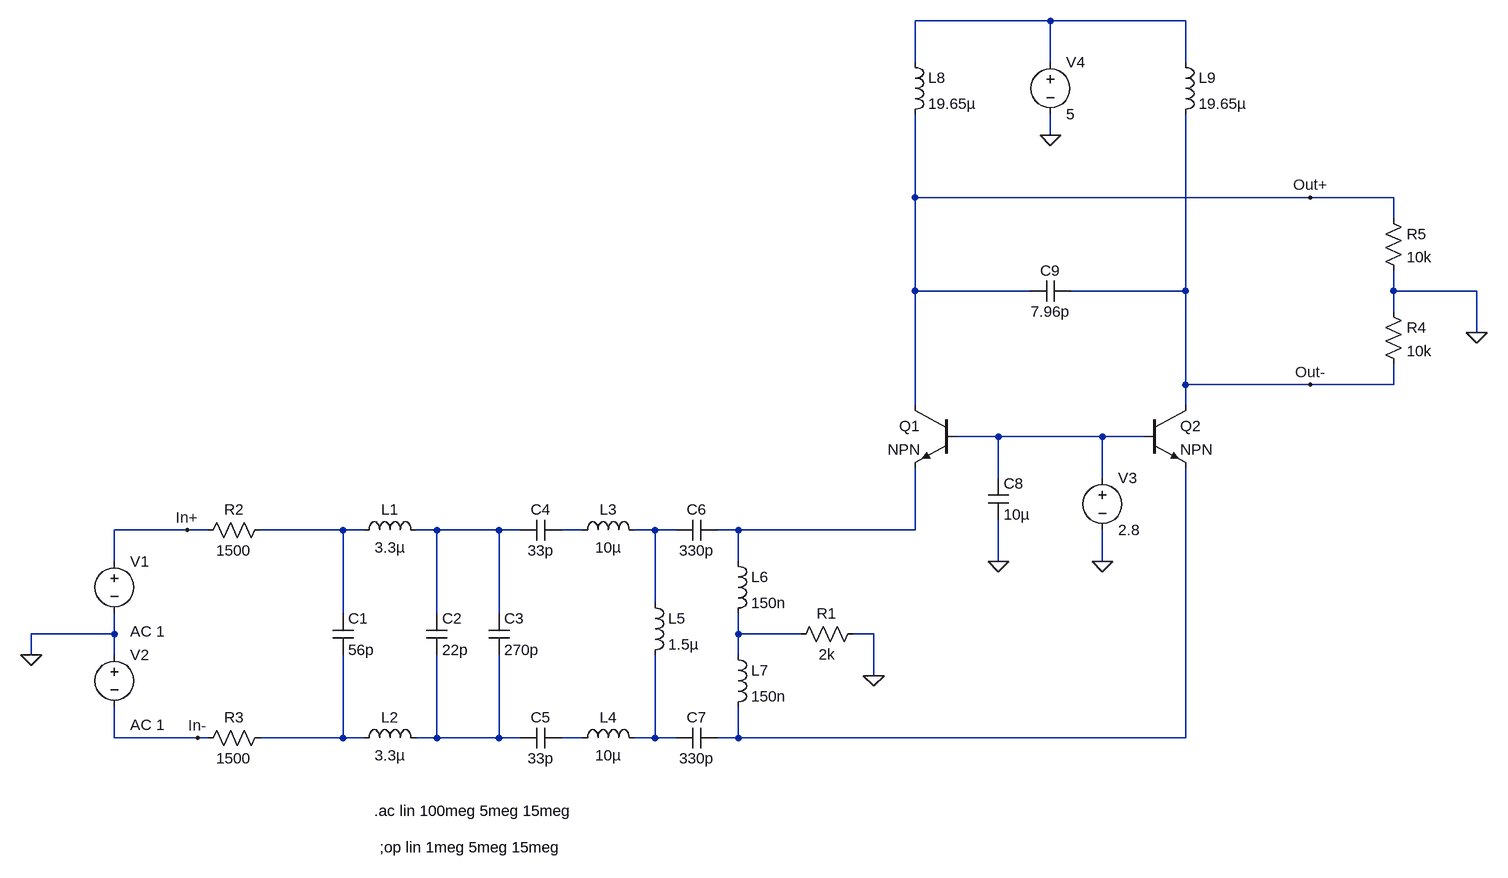
[diagram p0: schematic cb_diff_amp.asc]
cb_diff_amp.asc, the LTspice schematic file:
Version 4
SHEET 1 2580 680
WIRE 1040 -720 832 -720
WIRE 1248 -720 1040 -720
WIRE 832 -656 832 -720
WIRE 1040 -656 1040 -720
WIRE 1248 -656 1248 -720
WIRE 1040 -544 1040 -576
WIRE 832 -448 832 -576
WIRE 1440 -448 832 -448
WIRE 1568 -448 1440 -448
WIRE 1568 -416 1568 -448
WIRE 832 -304 832 -448
WIRE 1008 -304 832 -304
WIRE 1248 -304 1248 -576
WIRE 1248 -304 1072 -304
WIRE 1568 -304 1568 -336
WIRE 1696 -304 1568 -304
WIRE 1568 -272 1568 -304
WIRE 1696 -240 1696 -304
WIRE 1248 -160 1248 -304
WIRE 1440 -160 1248 -160
WIRE 1568 -160 1568 -192
WIRE 1568 -160 1440 -160
WIRE 832 -128 832 -304
WIRE 1248 -128 1248 -160
WIRE 960 -80 896 -80
WIRE 1120 -80 960 -80
WIRE 1184 -80 1120 -80
WIRE 960 -16 960 -80
WIRE 1120 -16 1120 -80
WIRE -288 64 -400 64
WIRE -256 64 -288 64
WIRE -48 64 -176 64
WIRE -16 64 -48 64
WIRE 96 64 64 64
WIRE 192 64 96 64
WIRE 224 64 192 64
WIRE 320 64 288 64
WIRE 432 64 400 64
WIRE 464 64 432 64
WIRE 560 64 528 64
WIRE 832 64 832 -32
WIRE 832 64 560 64
WIRE -400 112 -400 64
WIRE 560 112 560 64
WIRE 960 112 960 48
WIRE 1120 112 1120 64
WIRE 432 176 432 64
WIRE -48 192 -48 64
WIRE 96 192 96 64
WIRE 192 192 192 64
WIRE -400 224 -400 192
WIRE -400 224 -528 224
WIRE 560 224 560 192
WIRE 656 224 560 224
WIRE 768 224 736 224
WIRE -528 256 -528 224
WIRE -400 256 -400 224
WIRE 560 256 560 224
WIRE 768 288 768 224
WIRE -400 384 -400 336
WIRE -272 384 -400 384
WIRE -256 384 -272 384
WIRE -48 384 -48 256
WIRE -48 384 -176 384
WIRE -16 384 -48 384
WIRE 96 384 96 256
WIRE 96 384 64 384
WIRE 192 384 192 256
WIRE 192 384 96 384
WIRE 224 384 192 384
WIRE 320 384 288 384
WIRE 432 384 432 256
WIRE 432 384 400 384
WIRE 464 384 432 384
WIRE 560 384 560 336
WIRE 560 384 528 384
WIRE 1248 384 1248 -32
WIRE 1248 384 560 384
FLAG -288 64 In+
FLAG -272 384 In-
FLAG 960 112 0
FLAG 1120 112 0
FLAG 768 288 0
FLAG 1696 -240 0
FLAG 1040 -544 0
FLAG 1440 -448 Out+
FLAG 1440 -160 Out-
FLAG -528 256 0
SYMBOL cap -64 192 R0
SYMATTR InstName C1
SYMATTR Value 56p
SYMBOL cap 80 192 R0
SYMATTR InstName C2
SYMATTR Value 22p
SYMBOL cap 176 192 R0
SYMATTR InstName C3
SYMATTR Value 270p
SYMBOL cap 288 48 R90
WINDOW 0 0 32 VBottom 2
WINDOW 3 32 32 VTop 2
SYMATTR InstName C4
SYMATTR Value 33p
SYMBOL cap 288 368 R90
WINDOW 0 0 32 VBottom 2
WINDOW 3 32 32 VTop 2
SYMATTR InstName C5
SYMATTR Value 33p
SYMBOL cap 528 48 R90
WINDOW 0 0 32 VBottom 2
WINDOW 3 32 32 VTop 2
SYMATTR InstName C6
SYMATTR Value 330p
SYMBOL cap 528 368 R90
WINDOW 0 0 32 VBottom 2
WINDOW 3 32 32 VTop 2
SYMATTR InstName C7
SYMATTR Value 330p
SYMBOL ind -32 80 R270
WINDOW 0 32 56 VTop 2
WINDOW 3 5 56 VBottom 2
SYMATTR InstName L1
SYMATTR Value 3.3µ
SYMBOL ind -32 400 R270
WINDOW 0 32 56 VTop 2
WINDOW 3 5 56 VBottom 2
SYMATTR InstName L2
SYMATTR Value 3.3µ
SYMBOL ind 304 80 R270
WINDOW 0 32 56 VTop 2
WINDOW 3 5 56 VBottom 2
SYMATTR InstName L3
SYMATTR Value 10µ
SYMBOL ind 304 400 R270
WINDOW 0 32 56 VTop 2
WINDOW 3 5 56 VBottom 2
SYMATTR InstName L4
SYMATTR Value 10µ
SYMBOL ind 416 160 R0
SYMATTR InstName L5
SYMATTR Value 1.5µ
SYMBOL ind 544 96 R0
SYMATTR InstName L6
SYMATTR Value 150n
SYMBOL ind 544 240 R0
SYMATTR InstName L7
SYMATTR Value 150n
SYMBOL voltage -400 96 R0
WINDOW 123 24 124 Left 2
WINDOW 39 24 152 Left 2
SYMATTR InstName V1
SYMATTR Value ""
SYMATTR Value2 AC 1
SYMBOL res -160 48 R90
WINDOW 0 0 56 VBottom 2
WINDOW 3 32 56 VTop 2
SYMATTR InstName R2
SYMATTR Value 1500
SYMBOL res -160 368 R90
WINDOW 0 0 56 VBottom 2
WINDOW 3 32 56 VTop 2
SYMATTR InstName R3
SYMATTR Value 1500
SYMBOL voltage -400 240 R0
WINDOW 123 24 124 Left 2
WINDOW 39 0 0 Left 0
SYMATTR InstName V2
SYMATTR Value ""
SYMATTR Value2 AC 1
SYMBOL npn 896 -128 M0
SYMATTR InstName Q1
SYMBOL npn 1184 -128 R0
SYMATTR InstName Q2
SYMBOL voltage 1120 -32 R0
WINDOW 123 0 0 Left 0
WINDOW 39 0 0 Left 0
SYMATTR InstName V3
SYMATTR Value 2.8
SYMBOL cap 944 -16 R0
SYMATTR InstName C8
SYMATTR Value 10µ
SYMBOL res 752 208 R90
WINDOW 0 0 56 VBottom 2
WINDOW 3 32 56 VTop 2
SYMATTR InstName R1
SYMATTR Value 2k
SYMBOL res 1552 -288 R0
SYMATTR InstName R4
SYMATTR Value 10k
SYMBOL res 1552 -432 R0
SYMATTR InstName R5
SYMATTR Value 10k
SYMBOL cap 1072 -320 R90
WINDOW 0 0 32 VBottom 2
WINDOW 3 32 32 VTop 2
SYMATTR InstName C9
SYMATTR Value 7.96p
SYMBOL ind 816 -672 R0
SYMATTR InstName L8
SYMATTR Value 19.65µ
SYMBOL ind 1232 -672 R0
SYMATTR InstName L9
SYMATTR Value 19.65µ
SYMBOL voltage 1040 -672 R0
WINDOW 123 0 0 Left 0
WINDOW 39 0 0 Left 0
SYMATTR InstName V4
SYMATTR Value 5
TEXT 0 496 Left 2 !.ac lin 100meg 5meg 15meg
TEXT 8 552 Left 2 !;op lin 1meg 5meg 15meg

The netlist it stands for:
* cb_diff_amp.asc
C1 N003 N009 56p
C2 N004 N010 22p
C3 N004 N010 270p
C4 N005 N004 33p
C5 N011 N010 33p
C6 N007 N006 330p
C7 N013 N012 330p
L1 N003 N004 3.3µ
L2 N009 N010 3.3µ
L3 N005 N006 10µ
L4 N011 N012 10µ
L5 N006 N012 1.5µ
L6 N007 N008 150n
L7 N008 N013 150n
V1 In+ 0 AC 1
R2 N003 In+ 1500
R3 N009 In- 1500
V2 0 In- AC 1
Q1 Out+ N002 N007 0 NPN
Q2 Out- N002 N013 0 NPN
V3 N002 0 2.8
C8 N002 0 10µ
R1 0 N008 2k
R4 0 Out- 10k
R5 Out+ 0 10k
C9 Out- Out+ 7.96p
L8 N001 Out+ 19.65µ
L9 N001 Out- 19.65µ
V4 N001 0 5
.model NPN NPN
.model PNP PNP
.lib standard.bjt
.ac lin 100meg 5meg 15meg
;op lin 1meg 5meg 15meg
.backanno
.end